# EAGLE schematic singleboard (EAGLE 6.6.0)

## Sheet 1 of 5
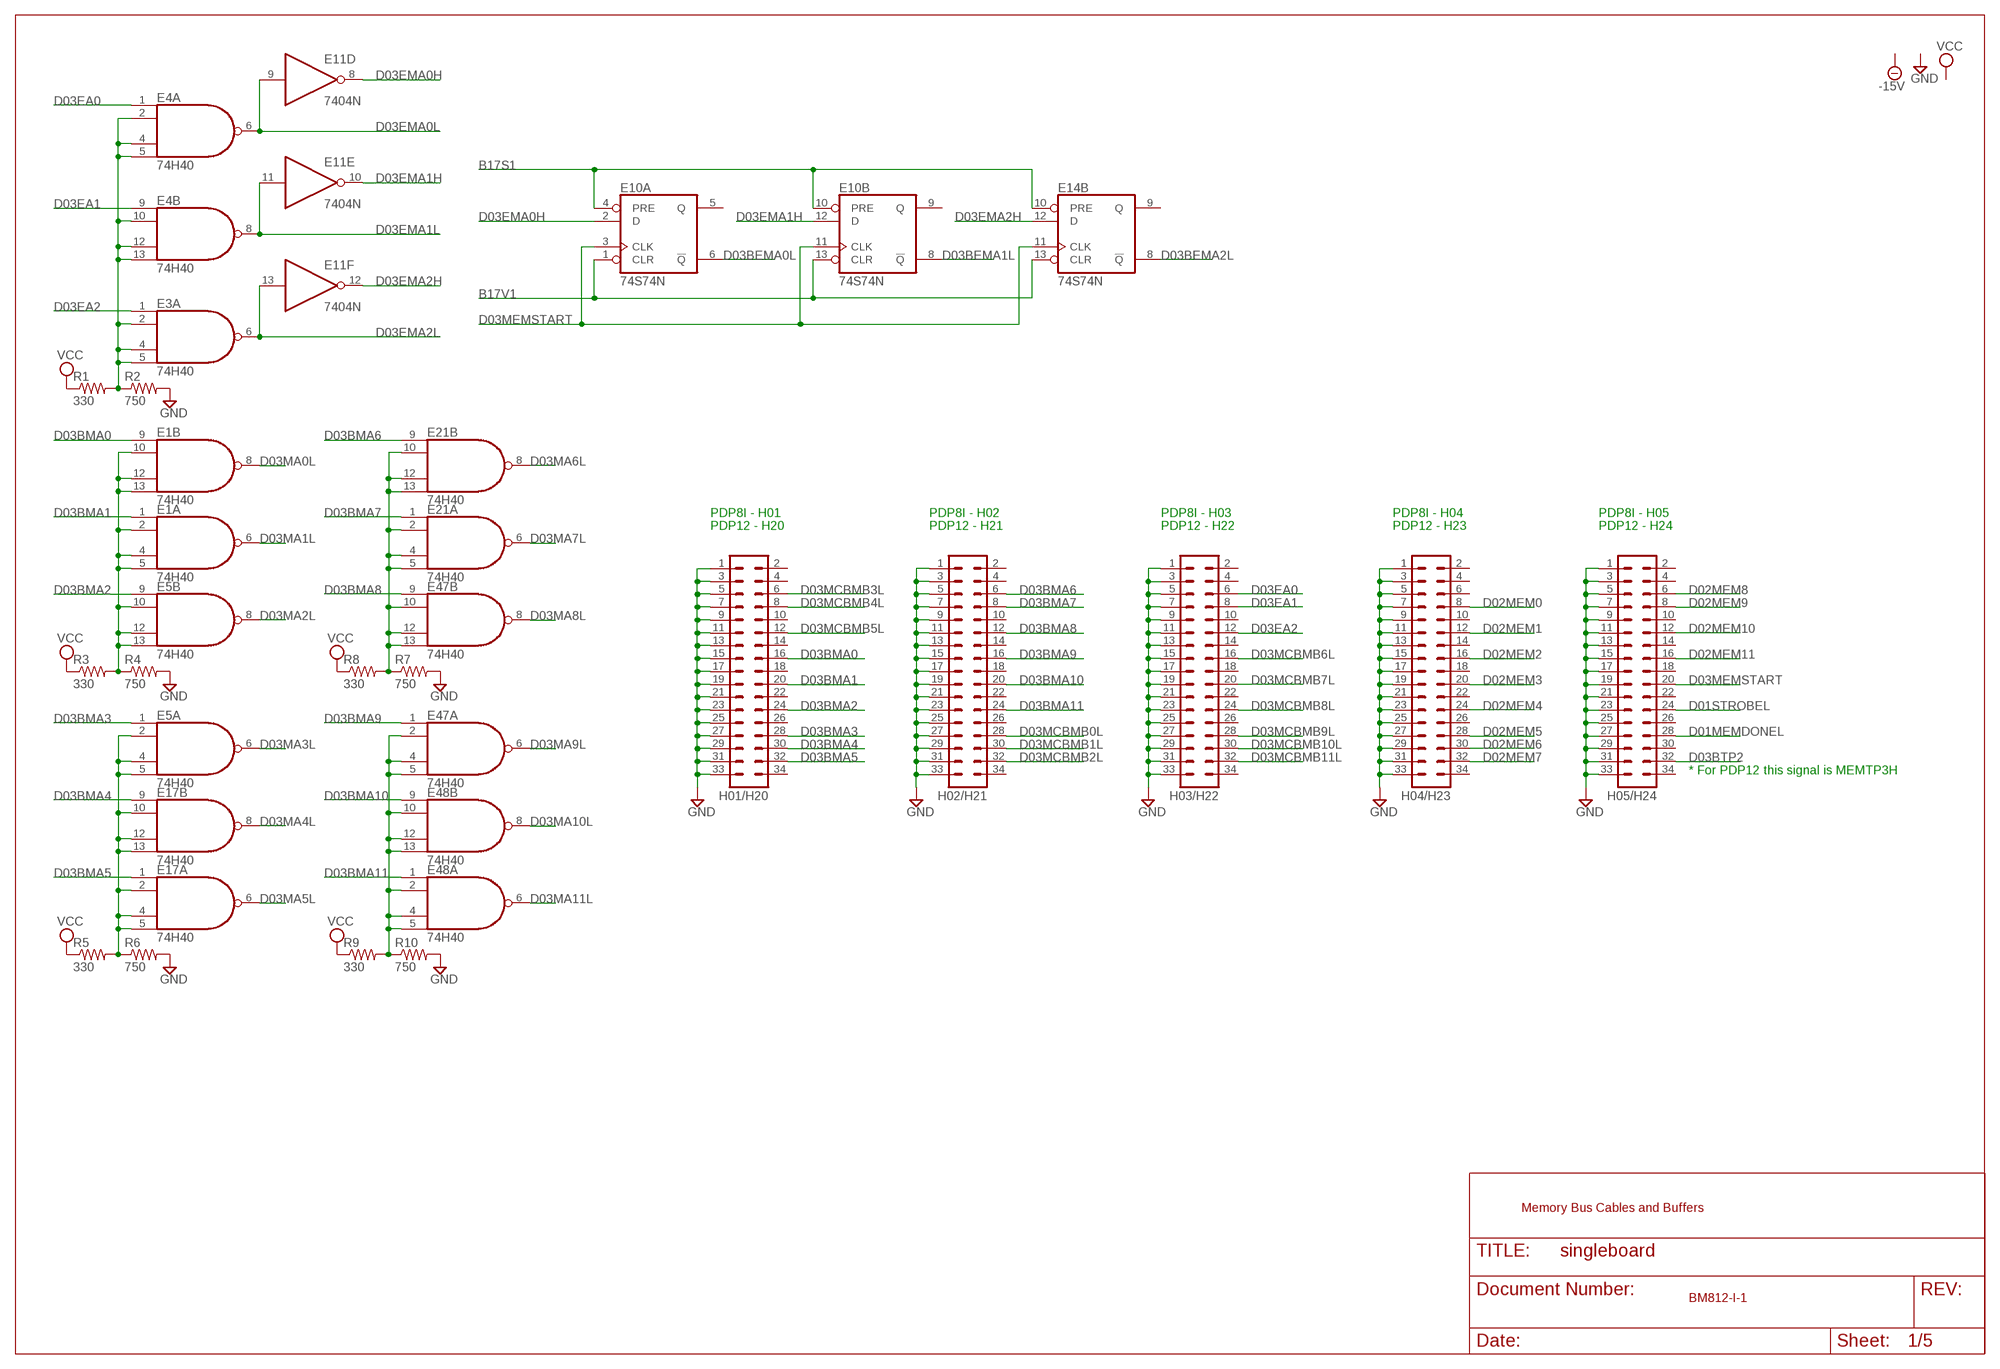
[diagram p0: schematic, sheet 1]

### Parts
E1  74H40  74S20N  [DIL14]
E3  74H40  74S20N  [DIL14]
E4  74H40  74S20N  [DIL14]
E5  74H40  74S20N  [DIL14]
E10  74S74N  [DIL14]
E11  7404N  [DIL14]
E14  74S74N  [DIL14]
E17  74H40  74S20N  [DIL14]
E21  74H40  74S20N  [DIL14]
E47  74H40  74S20N  [DIL14]
E48  74H40  74S20N  [DIL14]
H01/H20  MA17-2  [MA17-2]
H02/H21  MA17-2  [MA17-2]
H03/H22  MA17-2  [MA17-2]
H04/H23  MA17-2  [MA17-2]
H05/H24  MA17-2  [MA17-2]
R1  330  R-US_0207/10  [0207/10]
R2  750  R-US_0207/10  [0207/10]
R3  330  R-US_0207/10  [0207/10]
R4  750  R-US_0207/10  [0207/10]
R5  330  R-US_0207/10  [0207/10]
R6  750  R-US_0207/10  [0207/10]
R7  750  R-US_0207/10  [0207/10]
R8  330  R-US_0207/10  [0207/10]
R9  330  R-US_0207/10  [0207/10]
R10  750  R-US_0207/10  [0207/10]

### Nets
B17S1: E10.4(A:PRE) E10.10(B:PRE) E14.10(B:PRE) ; also sheet 3,4
B17V1: E10.1(A:CLR) E10.13(B:CLR) E14.13(B:CLR) ; also sheet 3,4
D01MEMDONEL: H05/H24.28 ; also sheet 4
D01STROBEL: H05/H24.24 ; also sheet 4
D02MEM0: H04/H23.8 ; also sheet 3
D02MEM1: H04/H23.12 ; also sheet 3
D02MEM2: H04/H23.16 ; also sheet 3
D02MEM3: H04/H23.20 ; also sheet 3
D02MEM4: H04/H23.24 ; also sheet 3
D02MEM5: H04/H23.28 ; also sheet 3
D02MEM6: H04/H23.30 ; also sheet 3
D02MEM7: H04/H23.32 ; also sheet 3
D02MEM8: H05/H24.6 ; also sheet 3
D02MEM9: H05/H24.8 ; also sheet 3
D02MEM10: H05/H24.12 ; also sheet 3
D02MEM11: H05/H24.16 ; also sheet 3
D03BEMA0L: E10.6(A:!Q) ; also sheet 5
D03BEMA1L: E10.8(B:!Q) ; also sheet 5
D03BEMA2L: E14.8(B:!Q) ; also sheet 5
D03BMA0: E1.9(B:I0) H01/H20.16
D03BMA1: E1.1(A:I0) H01/H20.20
D03BMA2: E5.9(B:I0) H01/H20.24
D03BMA3: E5.1(A:I0) H01/H20.28
D03BMA4: E17.9(B:I0) H01/H20.30
D03BMA5: E17.1(A:I0) H01/H20.32
D03BMA6: E21.9(B:I0) H02/H21.6
D03BMA7: E21.1(A:I0) H02/H21.8
D03BMA8: E47.9(B:I0) H02/H21.12
D03BMA9: E47.1(A:I0) H02/H21.16
D03BMA10: E48.9(B:I0) H02/H21.20
D03BMA11: E48.1(A:I0) H02/H21.24
D03BTP2: H05/H24.32 ; also sheet 4
D03EA0: E4.1(A:I0) H03/H22.6
D03EA1: E4.9(B:I0) H03/H22.8
D03EA2: E3.1(A:I0) H03/H22.12
D03EMA0H: E10.2(A:D) E11.8(D:O) ; also sheet 4
D03EMA0L: E4.6(A:O) E11.9(D:I) ; also sheet 4
D03EMA1H: E10.12(B:D) E11.10(E:O) ; also sheet 4
D03EMA1L: E4.8(B:O) E11.11(E:I) ; also sheet 4
D03EMA2H: E11.12(F:O) E14.12(B:D) ; also sheet 4
D03EMA2L: E3.6(A:O) E11.13(F:I) ; also sheet 4
D03MA0L: E1.8(B:O) ; also sheet 5
D03MA1L: E1.6(A:O) ; also sheet 5
D03MA2L: E5.8(B:O) ; also sheet 5
D03MA3L: E5.6(A:O) ; also sheet 5
D03MA4L: E17.8(B:O) ; also sheet 5
D03MA5L: E17.6(A:O) ; also sheet 5
D03MA6L: E21.8(B:O) ; also sheet 5
D03MA7L: E21.6(A:O) ; also sheet 5
D03MA8L: E47.8(B:O) ; also sheet 5
D03MA9L: E47.6(A:O) ; also sheet 5
D03MA10L: E48.8(B:O) ; also sheet 5
D03MA11L: E48.6(A:O) ; also sheet 5
D03MCBMB0L: H02/H21.28 ; also sheet 2
D03MCBMB1L: H02/H21.30 ; also sheet 2
D03MCBMB2L: H02/H21.32 ; also sheet 2
D03MCBMB3L: H01/H20.6 ; also sheet 2
D03MCBMB4L: H01/H20.8 ; also sheet 2
D03MCBMB5L: H01/H20.12 ; also sheet 2
D03MCBMB6L: H03/H22.16 ; also sheet 2
D03MCBMB7L: H03/H22.20 ; also sheet 2
D03MCBMB8L: H03/H22.24 ; also sheet 2
D03MCBMB9L: H03/H22.28 ; also sheet 2
D03MCBMB10L: H03/H22.30 ; also sheet 2
D03MCBMB11L: H03/H22.32 ; also sheet 2
D03MEMSTART: E10.3(A:CLK) E10.11(B:CLK) E14.11(B:CLK) H05/H24.20 ; also sheet 4
GND [Power]: H01/H20.1 H01/H20.3 H01/H20.5 H01/H20.7 H01/H20.9 H01/H20.11 H01/H20.13 H01/H20.15 H01/H20.17 H01/H20.19 H01/H20.21 H01/H20.23 H01/H20.25 H01/H20.27 H01/H20.29 H01/H20.31 H01/H20.33 H02/H21.1 H02/H21.3 H02/H21.5 H02/H21.7 H02/H21.9 H02/H21.11 H02/H21.13 H02/H21.15 H02/H21.17 H02/H21.19 H02/H21.21 H02/H21.23 H02/H21.25 H02/H21.27 H02/H21.29 H02/H21.31 H02/H21.33 H03/H22.1 H03/H22.3 H03/H22.5 H03/H22.7 H03/H22.9 H03/H22.11 H03/H22.13 H03/H22.15 H03/H22.17 H03/H22.19 H03/H22.21 H03/H22.23 H03/H22.25 H03/H22.27 H03/H22.29 H03/H22.31 H03/H22.33 H04/H23.1 H04/H23.3 H04/H23.5 H04/H23.7 H04/H23.9 H04/H23.11 H04/H23.13 H04/H23.15 H04/H23.17 H04/H23.19 H04/H23.21 H04/H23.23 H04/H23.25 H04/H23.27 H04/H23.29 H04/H23.31 H04/H23.33 H05/H24.1 H05/H24.3 H05/H24.5 H05/H24.7 H05/H24.9 H05/H24.11 H05/H24.13 H05/H24.15 H05/H24.17 H05/H24.19 H05/H24.21 H05/H24.23 H05/H24.25 H05/H24.27 H05/H24.29 H05/H24.31 H05/H24.33 R2.2 R4.2 R6.2 R7.2 R10.2 ; also sheet 2,4,5
N$1: E3.2(A:I1) E3.4(A:I2) E3.5(A:I3) E4.2(A:I1) E4.4(A:I2) E4.5(A:I3) E4.10(B:I1) E4.12(B:I2) E4.13(B:I3) R1.2 R2.1
N$2: E1.2(A:I1) E1.4(A:I2) E1.5(A:I3) E1.10(B:I1) E1.12(B:I2) E1.13(B:I3) E5.10(B:I1) E5.12(B:I2) E5.13(B:I3) R3.2 R4.1
N$4: E5.2(A:I1) E5.4(A:I2) E5.5(A:I3) E17.2(A:I1) E17.4(A:I2) E17.5(A:I3) E17.10(B:I1) E17.12(B:I2) E17.13(B:I3) R5.2 R6.1
N$6: E21.2(A:I1) E21.4(A:I2) E21.5(A:I3) E21.10(B:I1) E21.12(B:I2) E21.13(B:I3) E47.10(B:I1) E47.12(B:I2) E47.13(B:I3) R7.1 R8.2
N$36: E47.2(A:I1) E47.4(A:I2) E47.5(A:I3) E48.2(A:I1) E48.4(A:I2) E48.5(A:I3) E48.10(B:I1) E48.12(B:I2) E48.13(B:I3) R9.2 R10.1
VCC [Power]: R1.1 R3.1 R5.1 R8.1 R9.1 ; also sheet 2,4,5
Unconnected: E10.5(A:Q) E10.9(B:Q) E14.9(B:Q) H01/H20.2 H01/H20.4 H01/H20.10 H01/H20.14 H01/H20.18 H01/H20.22 H01/H20.26 H01/H20.34 H02/H21.2 H02/H21.4 H02/H21.10 H02/H21.14 H02/H21.18 H02/H21.22 H02/H21.26 H02/H21.34 H03/H22.2 H03/H22.4 H03/H22.10 H03/H22.14 H03/H22.18 H03/H22.22 H03/H22.26 H03/H22.34 H04/H23.2 H04/H23.4 H04/H23.6 H04/H23.10 H04/H23.14 H04/H23.18 H04/H23.22 H04/H23.26 H04/H23.34 H05/H24.2 H05/H24.4 H05/H24.10 H05/H24.14 H05/H24.18 H05/H24.22 H05/H24.26 H05/H24.30 H05/H24.34

### Notes on the sheet
- PDP8I - H01 | PDP8I - H02 | PDP8I - H03 | PDP8I - H04 | PDP8I - H05
- PDP12 - H20 | PDP12 - H21 | PDP12 - H22 | PDP12 - H23 | PDP12 - H24
- * For PDP12 this signal is MEMTP3H
- Memory Bus Cables and Buffers
- BM812-I-1

## Sheet 2 of 5
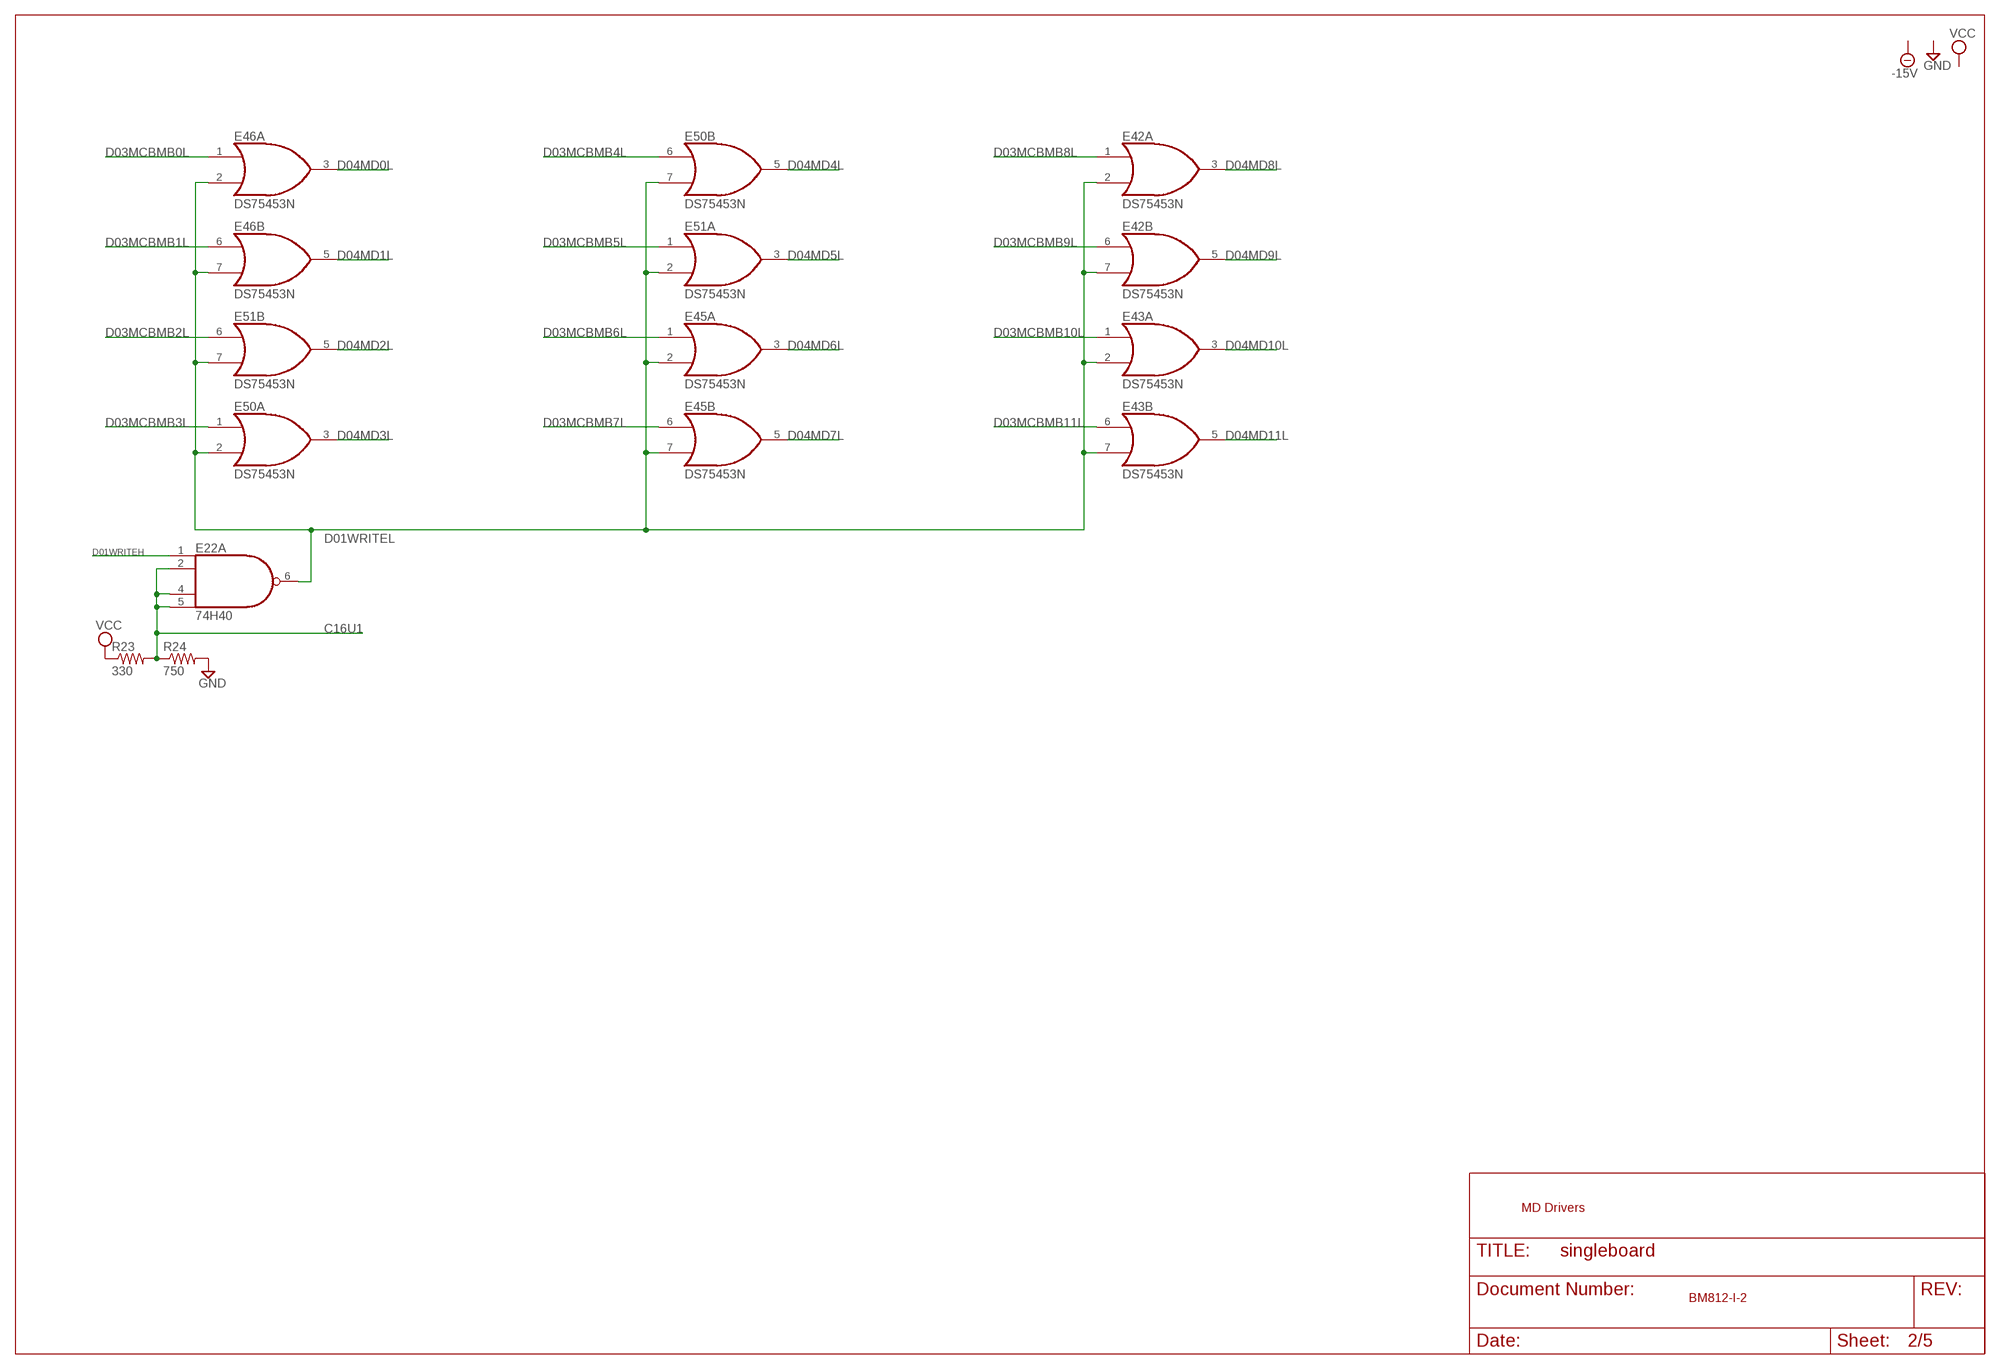
[diagram p1: schematic, sheet 2]

### Parts
E22  74H40  74S20N  [DIL14]
E42  DS75453N  [DIL08]
E43  DS75453N  [DIL08]
E45  DS75453N  [DIL08]
E46  DS75453N  [DIL08]
E50  DS75453N  [DIL08]
E51  DS75453N  [DIL08]
R23  330  R-US_0207/10  [0207/10]
R24  750  R-US_0207/10  [0207/10]

### Nets
C16U1: E22.2(A:I1) E22.4(A:I2) E22.5(A:I3) R23.2 R24.1 ; also sheet 3
D01WRITEH: E22.1(A:I0) ; also sheet 4
D01WRITEL: E22.6(A:O) E42.2(A:I1) E42.7(B:I1) E43.2(A:I1) E43.7(B:I1) E45.2(A:I1) E45.7(B:I1) E46.2(A:I1) E46.7(B:I1) E50.2(A:I1) E50.7(B:I1) E51.2(A:I1) E51.7(B:I1)
D03MCBMB0L: E46.1(A:I0) ; also sheet 1
D03MCBMB1L: E46.6(B:I0) ; also sheet 1
D03MCBMB2L: E51.6(B:I0) ; also sheet 1
D03MCBMB3L: E50.1(A:I0) ; also sheet 1
D03MCBMB4L: E50.6(B:I0) ; also sheet 1
D03MCBMB5L: E51.1(A:I0) ; also sheet 1
D03MCBMB6L: E45.1(A:I0) ; also sheet 1
D03MCBMB7L: E45.6(B:I0) ; also sheet 1
D03MCBMB8L: E42.1(A:I0) ; also sheet 1
D03MCBMB9L: E42.6(B:I0) ; also sheet 1
D03MCBMB10L: E43.1(A:I0) ; also sheet 1
D03MCBMB11L: E43.6(B:I0) ; also sheet 1
D04MD0L: E46.3(A:O) ; also sheet 3,5
D04MD1L: E46.5(B:O) ; also sheet 3,5
D04MD2L: E51.5(B:O) ; also sheet 3,5
D04MD3L: E50.3(A:O) ; also sheet 3,5
D04MD4L: E50.5(B:O) ; also sheet 3,5
D04MD5L: E51.3(A:O) ; also sheet 3,5
D04MD6L: E45.3(A:O) ; also sheet 3,5
D04MD7L: E45.5(B:O) ; also sheet 3,5
D04MD8L: E42.3(A:O) ; also sheet 3,5
D04MD9L: E42.5(B:O) ; also sheet 3,5
D04MD10L: E43.3(A:O) ; also sheet 3,5
D04MD11L: E43.5(B:O) ; also sheet 3,5
GND [Power]: R24.2 ; also sheet 1,4,5
VCC [Power]: R23.1 ; also sheet 1,4,5

### Notes on the sheet
- MD Drivers
- BM812-I-2

## Sheet 3 of 5
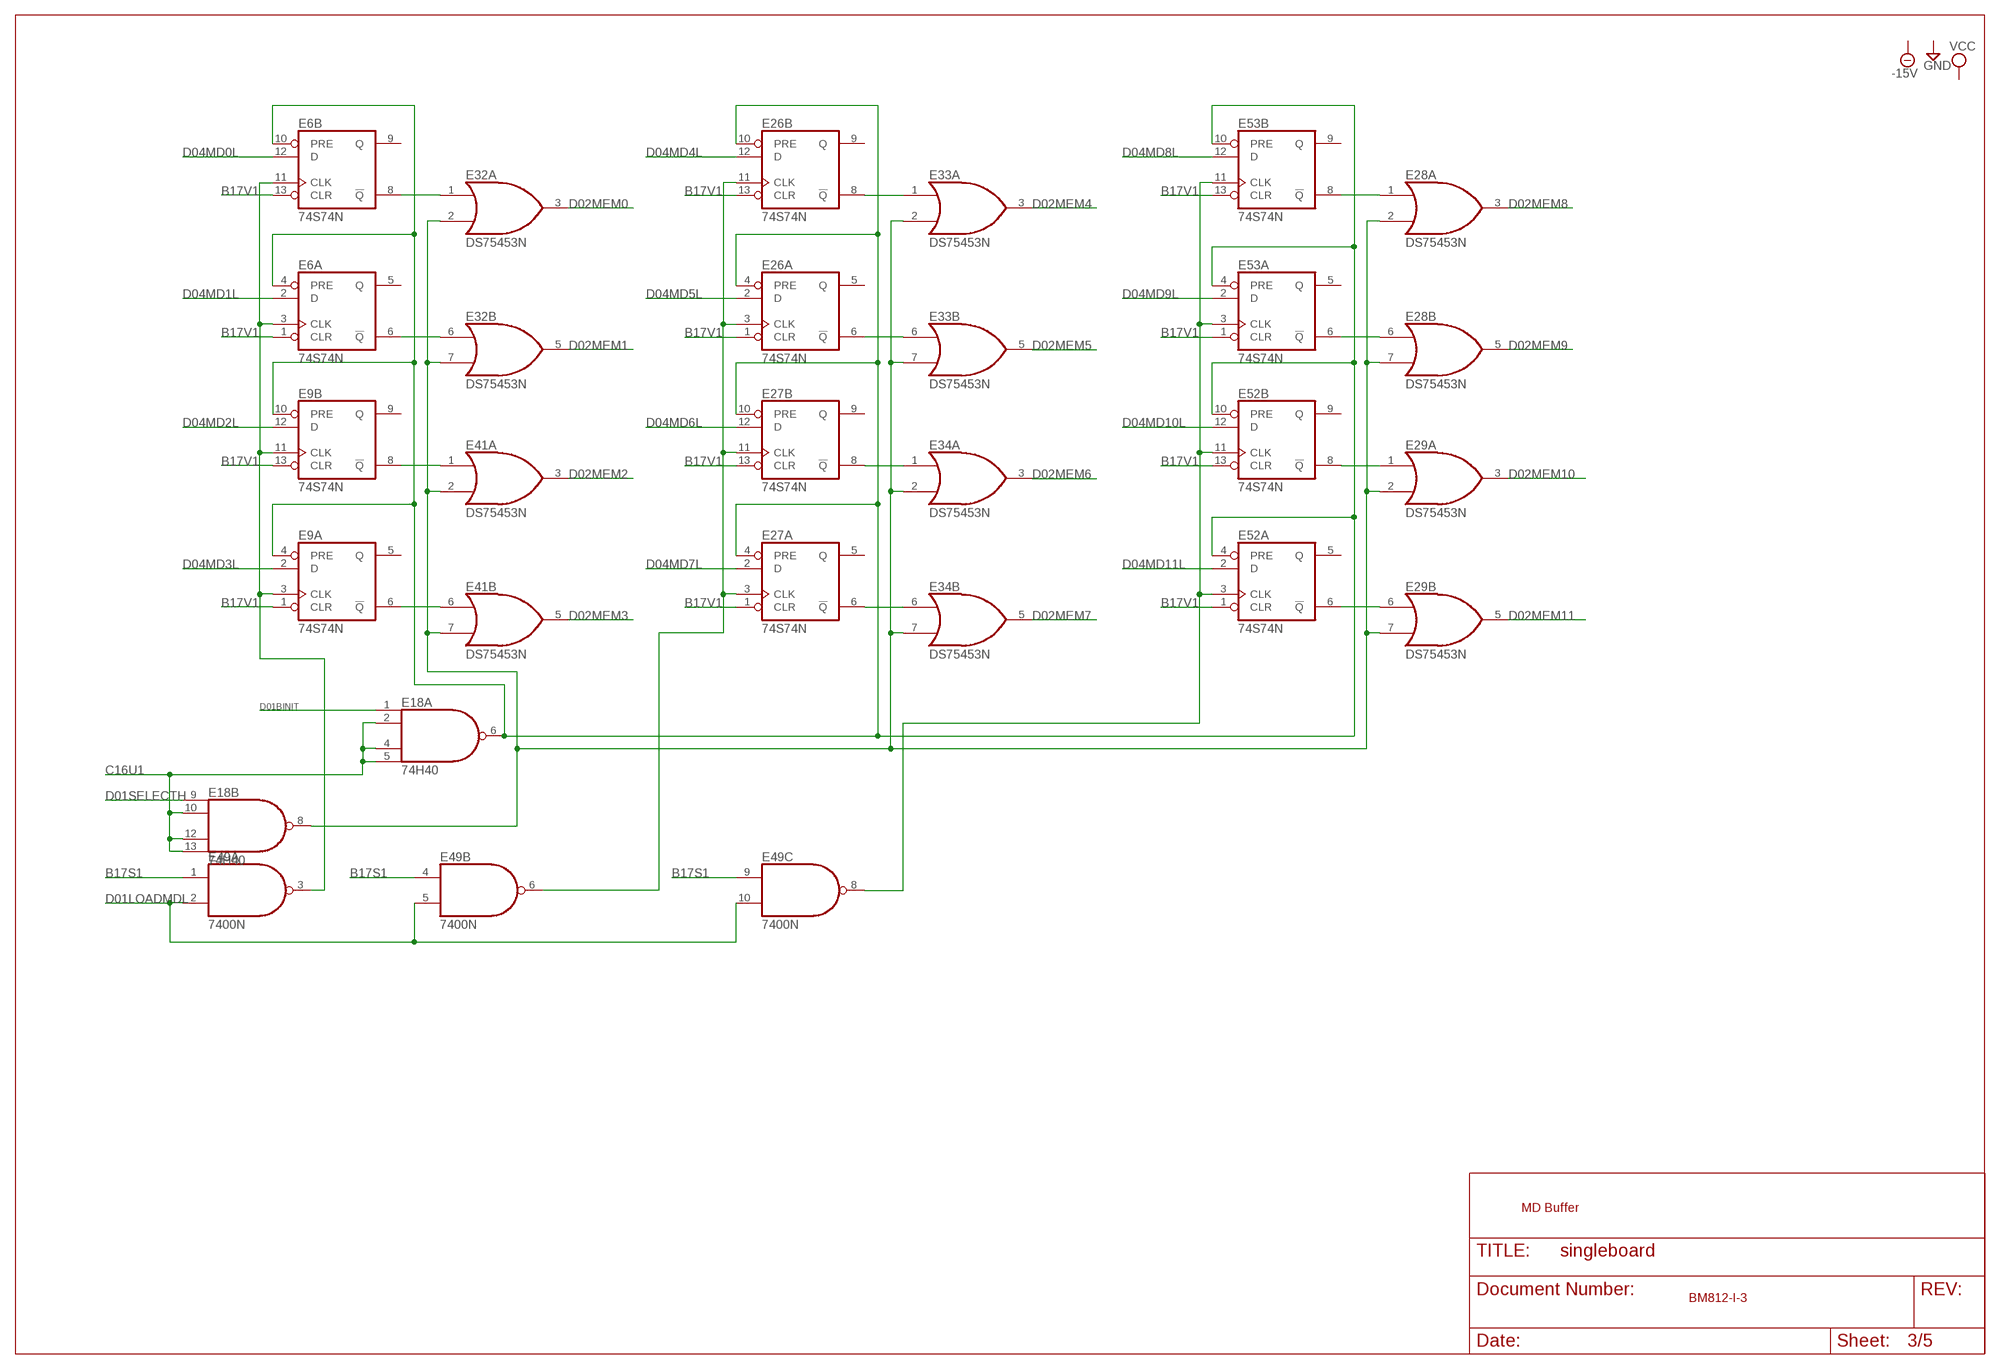
[diagram p2: schematic, sheet 3]

### Parts
E6  74S74N  [DIL14]
E9  74S74N  [DIL14]
E18  74H40  74S20N  [DIL14]
E26  74S74N  [DIL14]
E27  74S74N  [DIL14]
E28  DS75453N  [DIL08]
E29  DS75453N  [DIL08]
E32  DS75453N  [DIL08]
E33  DS75453N  [DIL08]
E34  DS75453N  [DIL08]
E41  DS75453N  [DIL08]
E49  7400N  [DIL14]
E52  74S74N  [DIL14]
E53  74S74N  [DIL14]

### Nets
B17S1: E49.1(A:I0) E49.4(B:I0) E49.9(C:I0) ; also sheet 1,4
B17V1: E6.1(A:CLR) E6.13(B:CLR) E9.1(A:CLR) E9.13(B:CLR) E26.1(A:CLR) E26.13(B:CLR) E27.1(A:CLR) E27.13(B:CLR) E52.1(A:CLR) E52.13(B:CLR) E53.1(A:CLR) E53.13(B:CLR) ; also sheet 1,4
C16U1: E18.2(A:I1) E18.4(A:I2) E18.5(A:I3) E18.10(B:I1) E18.12(B:I2) E18.13(B:I3) ; also sheet 2
D01BINIT: E18.1(A:I0) ; also sheet 4
D01LOADMDL: E49.2(A:I1) E49.5(B:I1) E49.10(C:I1) ; also sheet 4
D01SELECTH: E18.9(B:I0) ; also sheet 4
D02MEM0: E32.3(A:O) ; also sheet 1
D02MEM1: E32.5(B:O) ; also sheet 1
D02MEM2: E41.3(A:O) ; also sheet 1
D02MEM3: E41.5(B:O) ; also sheet 1
D02MEM4: E33.3(A:O) ; also sheet 1
D02MEM5: E33.5(B:O) ; also sheet 1
D02MEM6: E34.3(A:O) ; also sheet 1
D02MEM7: E34.5(B:O) ; also sheet 1
D02MEM8: E28.3(A:O) ; also sheet 1
D02MEM9: E28.5(B:O) ; also sheet 1
D02MEM10: E29.3(A:O) ; also sheet 1
D02MEM11: E29.5(B:O) ; also sheet 1
D04MD0L: E6.12(B:D) ; also sheet 2,5
D04MD1L: E6.2(A:D) ; also sheet 2,5
D04MD2L: E9.12(B:D) ; also sheet 2,5
D04MD3L: E9.2(A:D) ; also sheet 2,5
D04MD4L: E26.12(B:D) ; also sheet 2,5
D04MD5L: E26.2(A:D) ; also sheet 2,5
D04MD6L: E27.12(B:D) ; also sheet 2,5
D04MD7L: E27.2(A:D) ; also sheet 2,5
D04MD8L: E53.12(B:D) ; also sheet 2,5
D04MD9L: E53.2(A:D) ; also sheet 2,5
D04MD10L: E52.12(B:D) ; also sheet 2,5
D04MD11L: E52.2(A:D) ; also sheet 2,5
N$8: E6.3(A:CLK) E6.11(B:CLK) E9.3(A:CLK) E9.11(B:CLK) E49.3(A:O)
N$12: E9.6(A:!Q) E41.6(B:I0)
N$14: E6.8(B:!Q) E32.1(A:I0)
N$15: E6.6(A:!Q) E32.6(B:I0)
N$16: E26.3(A:CLK) E26.11(B:CLK) E27.3(A:CLK) E27.11(B:CLK) E49.6(B:O)
N$17: E9.8(B:!Q) E41.1(A:I0)
N$21: E6.4(A:PRE) E6.10(B:PRE) E9.4(A:PRE) E9.10(B:PRE) E18.6(A:O) E26.4(A:PRE) E26.10(B:PRE) E27.4(A:PRE) E27.10(B:PRE) E52.4(A:PRE) E52.10(B:PRE) E53.4(A:PRE) E53.10(B:PRE)
N$22: E18.8(B:O) E28.2(A:I1) E28.7(B:I1) E29.2(A:I1) E29.7(B:I1) E32.2(A:I1) E32.7(B:I1) E33.2(A:I1) E33.7(B:I1) E34.2(A:I1) E34.7(B:I1) E41.2(A:I1) E41.7(B:I1)
N$24: E26.6(A:!Q) E33.6(B:I0)
N$25: E27.6(A:!Q) E34.6(B:I0)
N$26: E27.8(B:!Q) E34.1(A:I0)
N$27: E26.8(B:!Q) E33.1(A:I0)
N$29: E29.6(B:I0) E52.6(A:!Q)
N$30: E29.1(A:I0) E52.8(B:!Q)
N$41: E49.8(C:O) E52.3(A:CLK) E52.11(B:CLK) E53.3(A:CLK) E53.11(B:CLK)
N$67: E28.6(B:I0) E53.6(A:!Q)
N$68: E28.1(A:I0) E53.8(B:!Q)
Unconnected: E6.5(A:Q) E6.9(B:Q) E9.5(A:Q) E9.9(B:Q) E26.5(A:Q) E26.9(B:Q) E27.5(A:Q) E27.9(B:Q) E52.5(A:Q) E52.9(B:Q) E53.5(A:Q) E53.9(B:Q)

### Notes on the sheet
- MD Buffer
- BM812-I-3

## Sheet 4 of 5
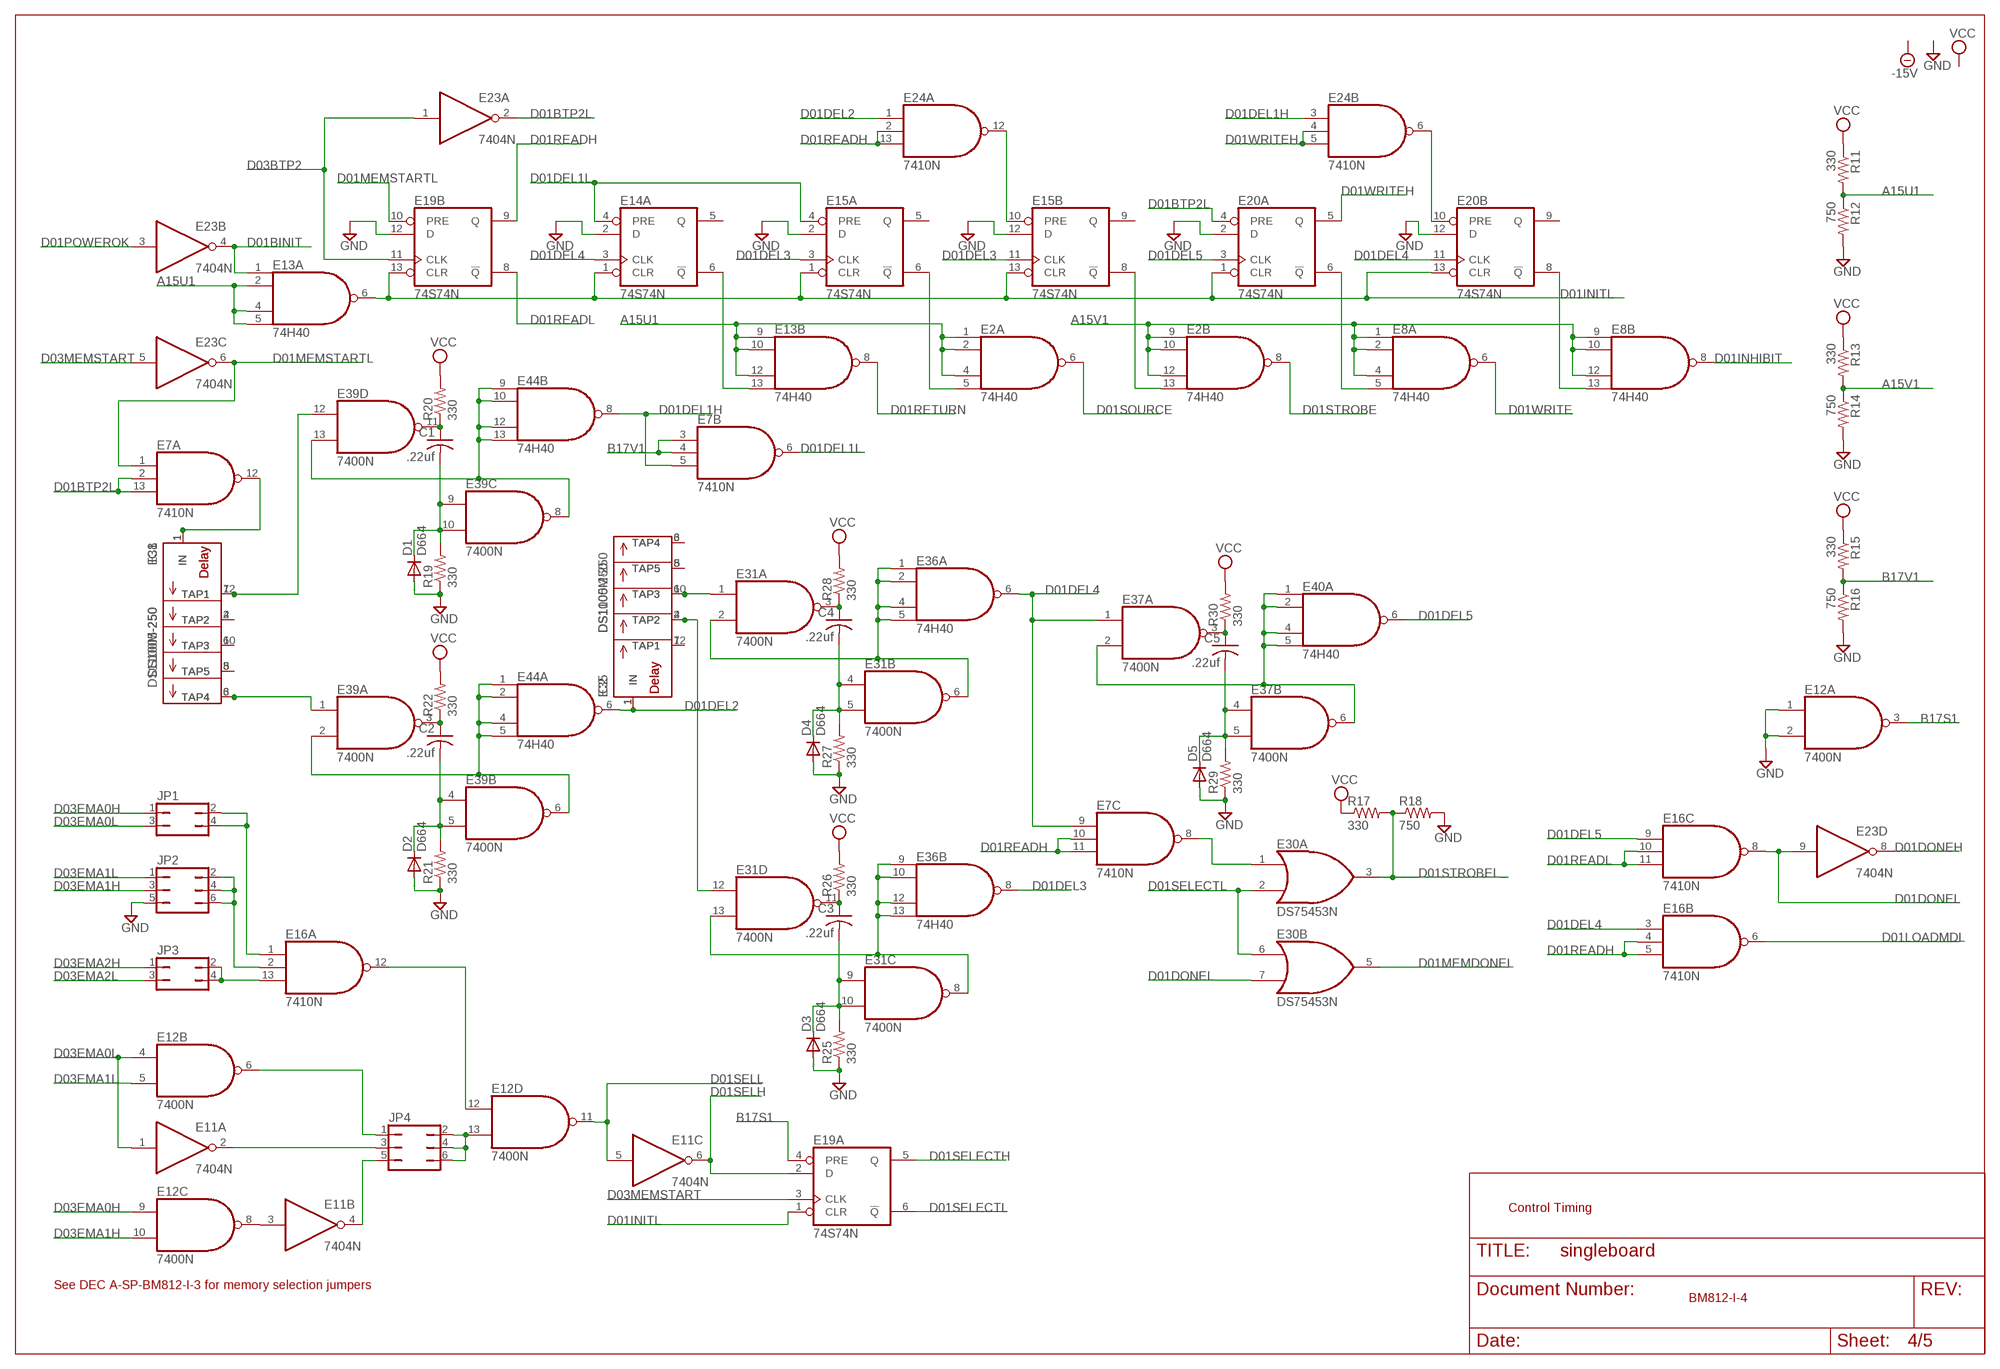
[diagram p3: schematic, sheet 4]

### Parts
C1  .22uf  C-US050-025X075  [C050-025X075]
C2  .22uf  C-US050-025X075  [C050-025X075]
C3  .22uf  C-US050-025X075  [C050-025X075]
C4  .22uf  C-US050-025X075  [C050-025X075]
C5  .22uf  C-US050-025X075  [C050-025X075]
D1  D664  1N4148DO35-10  [DO35-10]
D2  D664  1N4148DO35-10  [DO35-10]
D3  D664  1N4148DO35-10  [DO35-10]
D4  D664  1N4148DO35-10  [DO35-10]
D5  D664  1N4148DO35-10  [DO35-10]
E2  74H40  74S20N  [DIL14]
E7  7410N  [DIL14]
E8  74H40  74S20N  [DIL14]
E12  7400N  [DIL14]
E13  74H40  74S20N  [DIL14]
E15  74S74N  [DIL14]
E16  7410N  [DIL14]
E19  74S74N  [DIL14]
E20  74S74N  [DIL14]
E23  7404N  [DIL14]
E24  7410N  [DIL14]
E30  DS75453N  [DIL08]
E31  7400N  [DIL14]
E35  DS1005-250  MXD1000P  [DIL14]
E36  74H40  74S20N  [DIL14]
E37  7400N  [DIL14]
E38  DS1005-250  MXD1000P  [DIL14]
E39  7400N  [DIL14]
E40  74H40  74S20N  [DIL14]
E44  74H40  74S20N  [DIL14]
IC1  DS1100M-250  MXD1000  [DIL08]
IC2  DS1100M-250  MXD1000  [DIL08]
JP1  JP2Q  [JP2Q]
JP2  JP3Q  [JP3Q]
JP3  JP2Q  [JP2Q]
JP4  JP3Q  [JP3Q]
R11  330  R-US_0207/10  [0207/10]
R12  750  R-US_0207/10  [0207/10]
R13  330  R-US_0207/10  [0207/10]
R14  750  R-US_0207/10  [0207/10]
R15  330  R-US_0207/10  [0207/10]
R16  750  R-US_0207/10  [0207/10]
R17  330  R-US_0207/10  [0207/10]
R18  750  R-US_0207/10  [0207/10]
R19  330  R-US_0207/10  [0207/10]
R20  330  R-US_0207/10  [0207/10]
R21  330  R-US_0207/10  [0207/10]
R22  330  R-US_0207/10  [0207/10]
R25  330  R-US_0207/10  [0207/10]
R26  330  R-US_0207/10  [0207/10]
R27  330  R-US_0207/10  [0207/10]
R28  330  R-US_0207/10  [0207/10]
R29  330  R-US_0207/10  [0207/10]
R30  330  R-US_0207/10  [0207/10]

### Nets
A15U1: E2.1(A:I0) E2.2(A:I1) E2.4(A:I2) E13.2(A:I1) E13.4(A:I2) E13.5(A:I3) E13.9(B:I0) E13.10(B:I1) E13.12(B:I2) R11.2 R12.1 ; also sheet 5
A15V1: E2.9(B:I0) E2.10(B:I1) E2.12(B:I2) E8.1(A:I0) E8.2(A:I1) E8.4(A:I2) E8.9(B:I0) E8.10(B:I1) E8.12(B:I2) R13.2 R14.1
B17S1: E12.3(A:O) E19.4(A:PRE) ; also sheet 1,3
B17V1: E7.3(B:I0) E7.4(B:I1) R15.2 R16.1 ; also sheet 1,3
D01BINIT: E13.1(A:I0) E23.4(B:O) ; also sheet 3
D01BTP2L: E7.2(A:I1) E7.13(A:I2) E20.4(A:PRE) E23.2(A:O)
D01DEL1H: E7.5(B:I2) E24.3(B:I0) E44.8(B:O)
D01DEL1L: E7.6(B:O) E14.4(A:PRE) E15.4(A:PRE)
D01DEL2: E24.1(A:I0) E35.1(IN) E44.6(A:O) IC2.1(IN)
D01DEL3: E15.3(A:CLK) E15.11(B:CLK) E36.8(B:O)
D01DEL4: E7.9(C:I0) E14.3(A:CLK) E16.3(B:I0) E20.11(B:CLK) E36.6(A:O) E37.1(A:I0)
D01DEL5: E16.9(C:I0) E20.3(A:CLK) E40.6(A:O)
D01DONEH: E23.8(D:O) ; also sheet 5
D01DONEL: E16.8(C:O) E23.9(D:I) E30.7(B:I1)
D01INHIBIT: E8.8(B:O) ; also sheet 5
D01INITL: E13.6(A:O) E14.1(A:CLR) E15.1(A:CLR) E15.13(B:CLR) E19.1(A:CLR) E19.13(B:CLR) E20.1(A:CLR) E20.13(B:CLR)
D01LOADMDL: E16.6(B:O) ; also sheet 3
D01MEMDONEL: E30.5(B:O) ; also sheet 1
D01MEMSTARTL: E7.1(A:I0) E19.10(B:PRE) E23.6(C:O)
D01POWEROK: E23.3(B:I) ; also sheet 5
D01READH: E7.10(C:I1) E7.11(C:I2) E16.4(B:I1) E16.5(B:I2) E19.9(B:Q) E24.2(A:I1) E24.13(A:I2)
D01READL: E16.10(C:I1) E16.11(C:I2) E19.8(B:!Q) ; also sheet 5
D01RETURN: E13.8(B:O) ; also sheet 5
D01SELECTH: E19.5(A:Q) ; also sheet 3
D01SELECTL: E19.6(A:!Q) E30.2(A:I1) E30.6(B:I0)
D01SELH: E11.6(C:O) E19.2(A:D)
D01SELL: E11.5(C:I) E12.11(D:O)
D01SOURCE: E2.6(A:O) ; also sheet 5
D01STROBE: E2.8(B:O) ; also sheet 5
D01STROBEL: E30.3(A:O) R17.2 R18.1 ; also sheet 1
D01WRITE: E8.6(A:O) ; also sheet 5
D01WRITEH: E20.5(A:Q) E24.4(B:I1) E24.5(B:I2) ; also sheet 2
D03BTP2: E19.11(B:CLK) E23.1(A:I) ; also sheet 1
D03EMA0H: E12.9(C:I0) JP1.1 ; also sheet 1
D03EMA0L: E11.1(A:I) E12.4(B:I0) JP1.3 ; also sheet 1
D03EMA1H: E12.10(C:I1) JP2.3 ; also sheet 1
D03EMA1L: E12.5(B:I1) JP2.1 ; also sheet 1
D03EMA2H: JP3.1 ; also sheet 1
D03EMA2L: JP3.3 ; also sheet 1
D03MEMSTART: E19.3(A:CLK) E23.5(C:I) ; also sheet 1
GND [Power]: D1.A D2.A D3.A D4.A D5.A E12.1(A:I0) E12.2(A:I1) E14.2(A:D) E15.2(A:D) E15.12(B:D) E19.12(B:D) E20.2(A:D) E20.12(B:D) JP2.5 R12.2 R14.2 R16.2 R18.2 R19.1 R21.1 R25.1 R27.1 R29.1 ; also sheet 1,2,5
N$3: C3.2 D3.C E31.9(C:I0) E31.10(C:I1) R25.2
N$5: C5.2 D5.C E37.4(B:I0) E37.5(B:I1) R29.2
N$7: E12.13(D:I1) JP4.2 JP4.4 JP4.6
N$9: C2.2 D2.C E39.4(B:I0) E39.5(B:I1) R21.2
N$10: E38.12(TAP1) E39.12(D:I0) IC1.7(TAP1)
N$11: E31.12(D:I0) E35.4(TAP2) IC2.2(TAP2)
N$13: C1.2 D1.C E39.9(C:I0) E39.10(C:I1) R19.2
N$18: E39.8(C:O) E39.13(D:I1) E44.9(B:I0) E44.10(B:I1) E44.12(B:I2) E44.13(B:I3)
N$19: C1.1 E39.11(D:O) R20.1
N$20: C2.1 E39.3(A:O) R22.1
N$23: E39.2(A:I1) E39.6(B:O) E44.1(A:I0) E44.2(A:I1) E44.4(A:I2) E44.5(A:I3)
N$28: C3.1 E31.11(D:O) R26.1
N$31: E38.6(TAP4) E39.1(A:I0) IC1.3(TAP4)
N$32: E31.8(C:O) E31.13(D:I1) E36.9(B:I0) E36.10(B:I1) E36.12(B:I2) E36.13(B:I3)
N$33: C4.2 D4.C E31.4(B:I0) E31.5(B:I1) R27.2
N$34: C4.1 E31.3(A:O) R28.1
N$35: E7.12(A:O) E38.1(IN) IC1.1(IN)
N$37: E31.2(A:I1) E31.6(B:O) E36.1(A:I0) E36.2(A:I1) E36.4(A:I2) E36.5(A:I3)
N$38: E31.1(A:I0) E35.10(TAP3) IC2.6(TAP3)
N$39: C5.1 E37.3(A:O) R30.1
N$40: E37.2(A:I1) E37.6(B:O) E40.1(A:I0) E40.2(A:I1) E40.4(A:I2) E40.5(A:I3)
N$46: E15.10(B:PRE) E24.12(A:O)
N$48: E35.12(TAP1) IC2.7(TAP1)
N$49: E35.6(TAP4) IC2.3(TAP4)
N$50: E35.8(TAP5) IC2.5(TAP5)
N$51: E38.4(TAP2) IC1.2(TAP2)
N$52: E38.10(TAP3) IC1.6(TAP3)
N$53: E38.8(TAP5) IC1.5(TAP5)
N$73: E12.6(B:O) JP4.1
N$92: E20.10(B:PRE) E24.6(B:O)
N$94: E7.8(C:O) E30.1(A:I0)
N$96: E13.13(B:I3) E14.6(A:!Q)
N$100: E2.5(A:I3) E15.6(A:!Q)
N$101: E2.13(B:I3) E15.8(B:!Q)
N$103: E11.2(A:O) JP4.3
N$104: E8.5(A:I3) E20.6(A:!Q)
N$108: E11.3(B:I) E12.8(C:O)
N$109: E8.13(B:I3) E20.8(B:!Q)
N$111: E11.4(B:O) JP4.5
N$113: E16.13(A:I2) JP3.2 JP3.4
N$128: E16.2(A:I1) JP2.2 JP2.4 JP2.6
N$129: E16.1(A:I0) JP1.2 JP1.4
N$132: E12.12(D:I0) E16.12(A:O)
VCC [Power]: R11.1 R13.1 R15.1 R17.1 R20.2 R22.2 R26.2 R28.2 R30.2 ; also sheet 1,2,5
Unconnected: E14.5(A:Q) E15.5(A:Q) E15.9(B:Q) E20.9(B:Q) E35.2(NC) E35.3(NC) E35.5(NC) E35.9(NC) E35.11(NC) E35.13(NC) E38.2(NC) E38.3(NC) E38.5(NC) E38.9(NC) E38.11(NC) E38.13(NC)

### Notes on the sheet
- Control Timing
- See DEC A-SP-BM812-I-3 for memory selection jumpers
- BM812-I-4

## Sheet 5 of 5
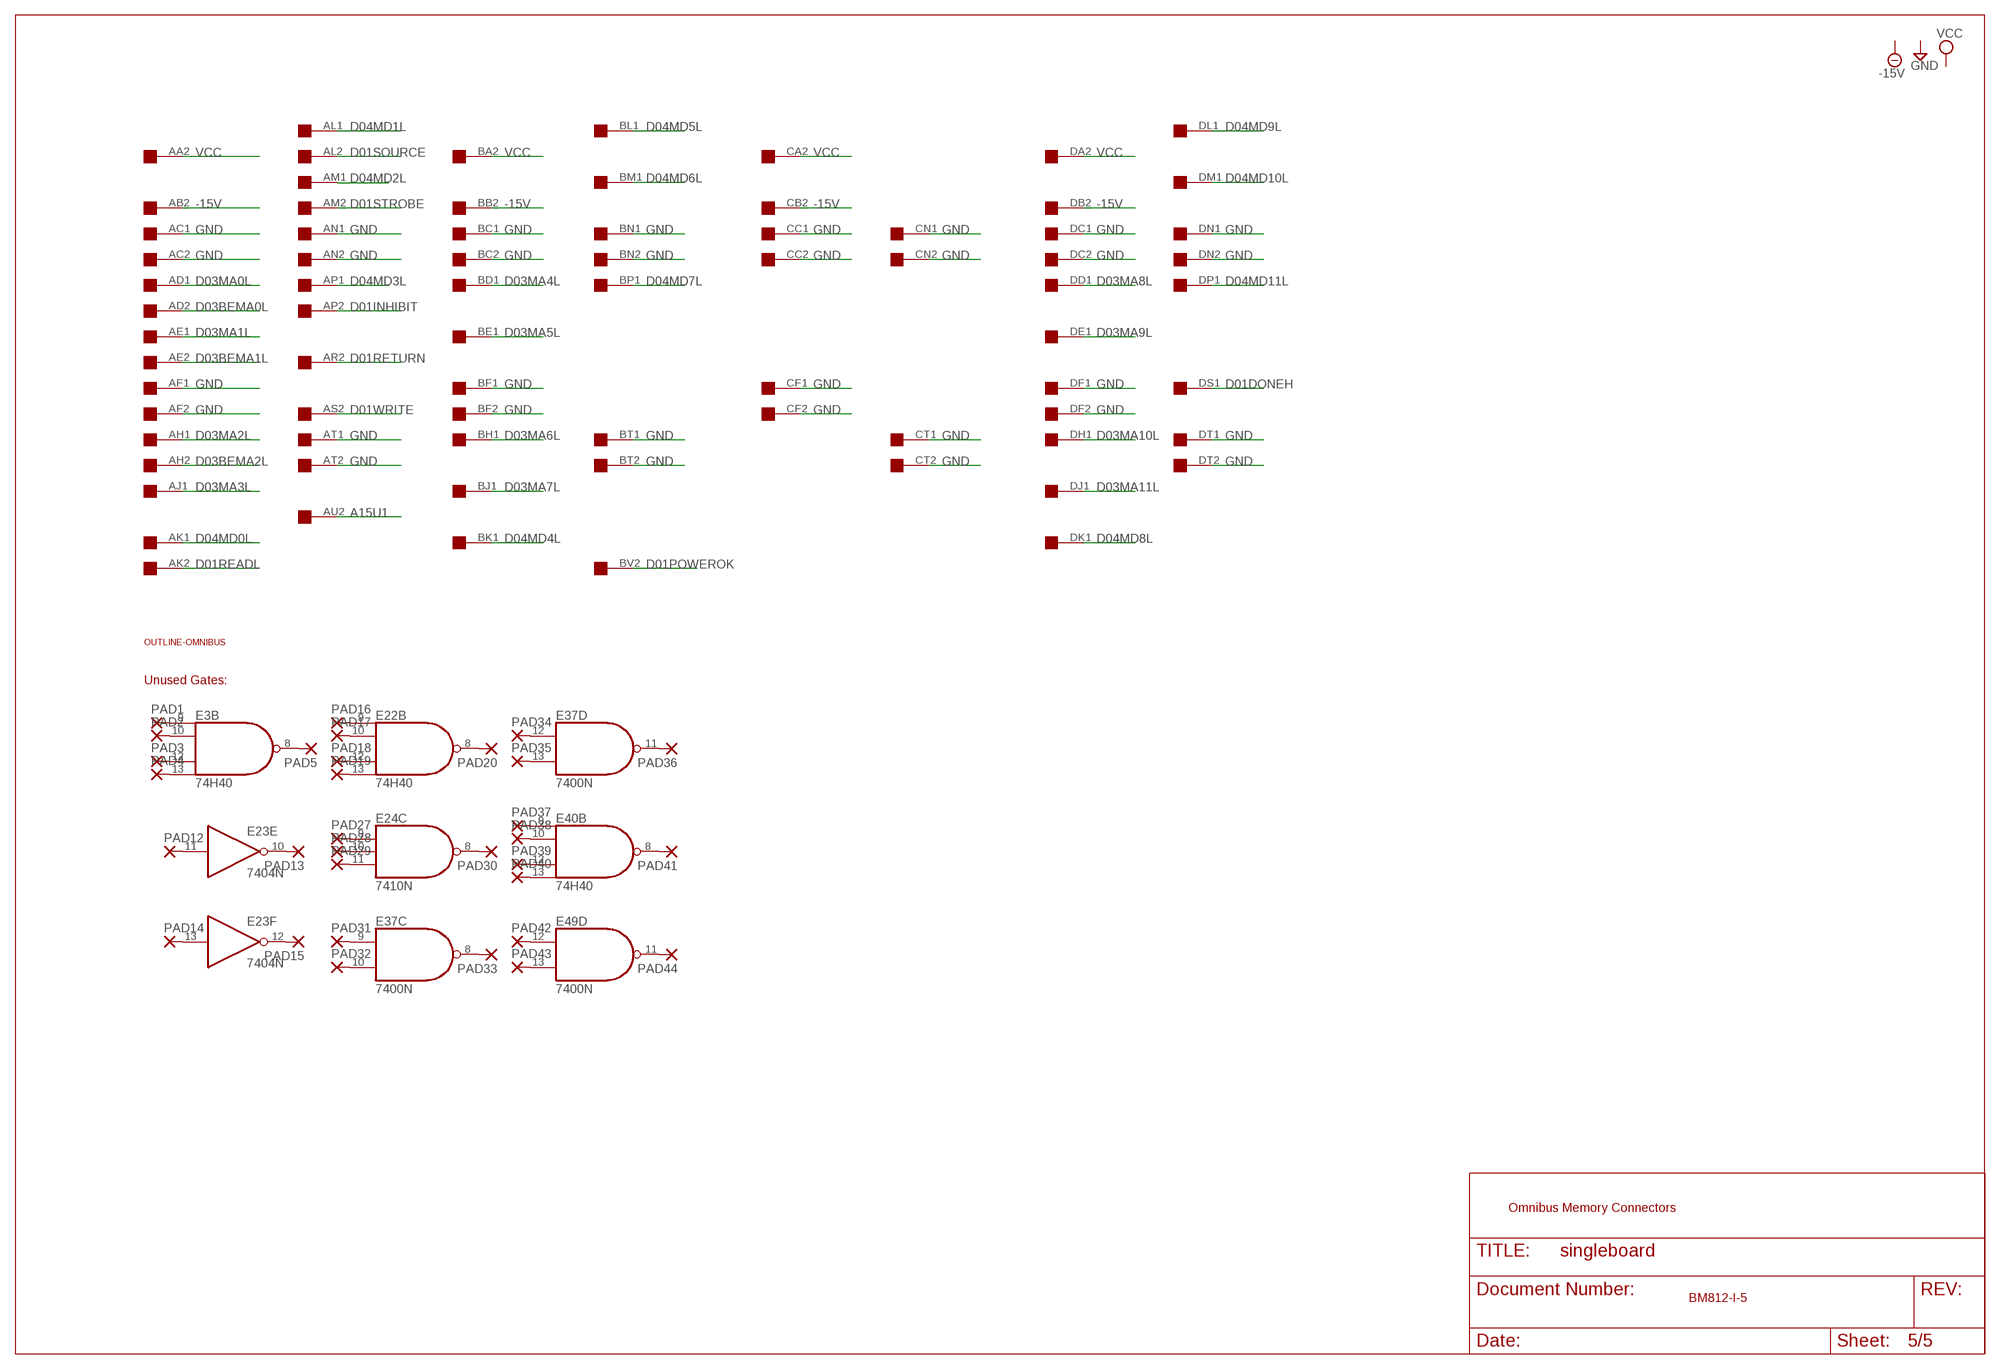
[diagram p4: schematic, sheet 5]

### Parts
PAD1  1,6/0,8  [1,6/0,8]
PAD2  1,6/0,8  [1,6/0,8]
PAD3  1,6/0,8  [1,6/0,8]
PAD4  1,6/0,8  [1,6/0,8]
PAD5  1,6/0,8  [1,6/0,8]
PAD12  1,6/0,8  [1,6/0,8]
PAD13  1,6/0,8  [1,6/0,8]
PAD14  1,6/0,8  [1,6/0,8]
PAD15  1,6/0,8  [1,6/0,8]
PAD16  1,6/0,8  [1,6/0,8]
PAD17  1,6/0,8  [1,6/0,8]
PAD18  1,6/0,8  [1,6/0,8]
PAD19  1,6/0,8  [1,6/0,8]
PAD20  1,6/0,8  [1,6/0,8]
PAD27  1,6/0,8  [1,6/0,8]
PAD28  1,6/0,8  [1,6/0,8]
PAD29  1,6/0,8  [1,6/0,8]
PAD30  1,6/0,8  [1,6/0,8]
PAD31  1,6/0,8  [1,6/0,8]
PAD32  1,6/0,8  [1,6/0,8]
PAD33  1,6/0,8  [1,6/0,8]
PAD34  1,6/0,8  [1,6/0,8]
PAD35  1,6/0,8  [1,6/0,8]
PAD36  1,6/0,8  [1,6/0,8]
PAD37  1,6/0,8  [1,6/0,8]
PAD38  1,6/0,8  [1,6/0,8]
PAD39  1,6/0,8  [1,6/0,8]
PAD40  1,6/0,8  [1,6/0,8]
PAD41  1,6/0,8  [1,6/0,8]
PAD42  1,6/0,8  [1,6/0,8]
PAD43  1,6/0,8  [1,6/0,8]
PAD44  1,6/0,8  [1,6/0,8]
U$1  QUAD  [EDGE-CON8]
U$2  OUTLINE-OMNIBUS  [OMNIBUS]

### Nets
-15V [Power]: U$1.AB2 U$1.BB2 U$1.CB2 U$1.DB2
A15U1: U$1.AU2 ; also sheet 4
D01DONEH: U$1.DS1 ; also sheet 4
D01INHIBIT: U$1.AP2 ; also sheet 4
D01POWEROK: U$1.BV2 ; also sheet 4
D01READL: U$1.AK2 ; also sheet 4
D01RETURN: U$1.AR2 ; also sheet 4
D01SOURCE: U$1.AL2 ; also sheet 4
D01STROBE: U$1.AM2 ; also sheet 4
D01WRITE: U$1.AS2 ; also sheet 4
D03BEMA0L: U$1.AD2 ; also sheet 1
D03BEMA1L: U$1.AE2 ; also sheet 1
D03BEMA2L: U$1.AH2 ; also sheet 1
D03MA0L: U$1.AD1 ; also sheet 1
D03MA1L: U$1.AE1 ; also sheet 1
D03MA2L: U$1.AH1 ; also sheet 1
D03MA3L: U$1.AJ1 ; also sheet 1
D03MA4L: U$1.BD1 ; also sheet 1
D03MA5L: U$1.BE1 ; also sheet 1
D03MA6L: U$1.BH1 ; also sheet 1
D03MA7L: U$1.BJ1 ; also sheet 1
D03MA8L: U$1.DD1 ; also sheet 1
D03MA9L: U$1.DE1 ; also sheet 1
D03MA10L: U$1.DH1 ; also sheet 1
D03MA11L: U$1.DJ1 ; also sheet 1
D04MD0L: U$1.AK1 ; also sheet 2,3
D04MD1L: U$1.AL1 ; also sheet 2,3
D04MD2L: U$1.AM1 ; also sheet 2,3
D04MD3L: U$1.AP1 ; also sheet 2,3
D04MD4L: U$1.BK1 ; also sheet 2,3
D04MD5L: U$1.BL1 ; also sheet 2,3
D04MD6L: U$1.BM1 ; also sheet 2,3
D04MD7L: U$1.BP1 ; also sheet 2,3
D04MD8L: U$1.DK1 ; also sheet 2,3
D04MD9L: U$1.DL1 ; also sheet 2,3
D04MD10L: U$1.DM1 ; also sheet 2,3
D04MD11L: U$1.DP1 ; also sheet 2,3
GND [Power]: U$1.AC1 U$1.AC2 U$1.AF1 U$1.AF2 U$1.AN1 U$1.AN2 U$1.AT1 U$1.AT2 U$1.BC1 U$1.BC2 U$1.BF1 U$1.BF2 U$1.BN1 U$1.BN2 U$1.BT1 U$1.BT2 U$1.CC1 U$1.CC2 U$1.CF1 U$1.CF2 U$1.CN1 U$1.CN2 U$1.CT1 U$1.CT2 U$1.DC1 U$1.DC2 U$1.DF1 U$1.DF2 U$1.DN1 U$1.DN2 U$1.DT1 U$1.DT2 ; also sheet 1,2,4
N$42: E3.9(B:I0) PAD1.1(P)
N$43: E3.10(B:I1) PAD2.1(P)
N$44: E3.12(B:I2) PAD3.1(P)
N$45: E3.13(B:I3) PAD4.1(P)
N$47: E3.8(B:O) PAD5.1(P)
N$54: E23.11(E:I) PAD12.1(P)
N$55: E23.10(E:O) PAD13.1(P)
N$56: E23.13(F:I) PAD14.1(P)
N$57: E23.12(F:O) PAD15.1(P)
N$58: E22.9(B:I0) PAD16.1(P)
N$59: E22.10(B:I1) PAD17.1(P)
N$60: E22.12(B:I2) PAD18.1(P)
N$61: E22.13(B:I3) PAD19.1(P)
N$62: E22.8(B:O) PAD20.1(P)
N$71: E24.9(C:I0) PAD27.1(P)
N$72: E24.10(C:I1) PAD28.1(P)
N$74: E24.11(C:I2) PAD29.1(P)
N$75: E24.8(C:O) PAD30.1(P)
N$76: E37.9(C:I0) PAD31.1(P)
N$77: E37.10(C:I1) PAD32.1(P)
N$78: E37.8(C:O) PAD33.1(P)
N$79: E37.12(D:I0) PAD34.1(P)
N$80: E37.13(D:I1) PAD35.1(P)
N$81: E37.11(D:O) PAD36.1(P)
N$82: E40.9(B:I0) PAD37.1(P)
N$83: E40.10(B:I1) PAD38.1(P)
N$84: E40.12(B:I2) PAD39.1(P)
N$85: E40.13(B:I3) PAD40.1(P)
N$86: E40.8(B:O) PAD41.1(P)
N$87: E49.12(D:I0) PAD42.1(P)
N$88: E49.13(D:I1) PAD43.1(P)
N$89: E49.11(D:O) PAD44.1(P)
VCC [Power]: U$1.AA2 U$1.BA2 U$1.CA2 U$1.DA2 ; also sheet 1,2,4
Unconnected: U$1.AA1 U$1.AB1 U$1.AJ2 U$1.AR1 U$1.AS1 U$1.AU1 U$1.AV1 U$1.AV2 U$1.BA1 U$1.BB1 U$1.BD2 U$1.BE2 U$1.BH2 U$1.BJ2 U$1.BK2 U$1.BL2 U$1.BM2 U$1.BP2 U$1.BR1 U$1.BR2 U$1.BS1 U$1.BS2 U$1.BU1 U$1.BU2 U$1.BV1 U$1.CA1 U$1.CB1 U$1.CD1 U$1.CD2 U$1.CE1 U$1.CE2 U$1.CH1 U$1.CH2 U$1.CJ1 U$1.CJ2 U$1.CK1 U$1.CK2 U$1.CL1 U$1.CL2 U$1.CM1 U$1.CM2 U$1.CP1 U$1.CP2 U$1.CR1 U$1.CR2 U$1.CS1 U$1.CS2 U$1.CU1 U$1.CU2 U$1.CV1 U$1.CV2 U$1.DA1 U$1.DB1 U$1.DD2 U$1.DE2 U$1.DH2 U$1.DJ2 U$1.DK2 U$1.DL2 U$1.DM2 U$1.DP2 U$1.DR1 U$1.DR2 U$1.DS2 U$1.DU1 U$1.DU2 U$1.DV1 U$1.DV2

### Notes on the sheet
- Unused Gates:
- Omnibus Memory Connectors
- BM812-I-5

## Power pins joined to a net without a drawn wire
GND: E1.7(P:GND) E2.7(P:GND) E3.7(P:GND) E4.7(P:GND) E5.7(P:GND) E6.7(P:GND) E7.7(P:GND) E8.7(P:GND) E9.7(P:GND) E10.7(P:GND) E11.7(P:GND) E12.7(P:GND) E13.7(P:GND) E14.7(P:GND) E15.7(P:GND) E16.7(P:GND) E17.7(P:GND) E18.7(P:GND) E19.7(P:GND) E20.7(P:GND) E21.7(P:GND) E22.7(P:GND) E23.7(P:GND) E24.7(P:GND) E26.7(P:GND) E27.7(P:GND) E28.4(P:GND) E29.4(P:GND) E30.4(P:GND) E31.7(P:GND) E32.4(P:GND) E33.4(P:GND) E34.4(P:GND) E35.7(GND) E36.7(P:GND) E37.7(P:GND) E38.7(GND) E39.7(P:GND) E40.7(P:GND) E41.4(P:GND) E42.4(P:GND) E43.4(P:GND) E44.7(P:GND) E45.4(P:GND) E46.4(P:GND) E47.7(P:GND) E48.7(P:GND) E49.7(P:GND) E50.4(P:GND) E51.4(P:GND) E52.7(P:GND) E53.7(P:GND) IC1.4(GND) IC2.4(GND)
VCC: E1.14(P:VCC) E2.14(P:VCC) E3.14(P:VCC) E4.14(P:VCC) E5.14(P:VCC) E6.14(P:VCC) E7.14(P:VCC) E8.14(P:VCC) E9.14(P:VCC) E10.14(P:VCC) E11.14(P:VCC) E12.14(P:VCC) E13.14(P:VCC) E14.14(P:VCC) E15.14(P:VCC) E16.14(P:VCC) E17.14(P:VCC) E18.14(P:VCC) E19.14(P:VCC) E20.14(P:VCC) E21.14(P:VCC) E22.14(P:VCC) E23.14(P:VCC) E24.14(P:VCC) E26.14(P:VCC) E27.14(P:VCC) E28.8(P:VCC) E29.8(P:VCC) E30.8(P:VCC) E31.14(P:VCC) E32.8(P:VCC) E33.8(P:VCC) E34.8(P:VCC) E35.14(VCC) E36.14(P:VCC) E37.14(P:VCC) E38.14(VCC) E39.14(P:VCC) E40.14(P:VCC) E41.8(P:VCC) E42.8(P:VCC) E43.8(P:VCC) E44.14(P:VCC) E45.8(P:VCC) E46.8(P:VCC) E47.14(P:VCC) E48.14(P:VCC) E49.14(P:VCC) E50.8(P:VCC) E51.8(P:VCC) E52.14(P:VCC) E53.14(P:VCC) IC1.8(VCC) IC2.8(VCC)

## Library data of the parts
C1-C5 = rcl:C-US: CAPACITOR, American symbol
D1-D5 = diode:1N4148: DIODE high speed (Philips)
E1-E5 E8 E13 E17 E18 E21 E22 E36 E40 E44 E47 E48 = 74xx-us:74*20: Dual 4-input NAND gate
E6 E9 E10 E14 E15 E19 E20 E26 E27 E52 E53 = 74xx-us:74*74: Dual D type positive edge triggered FLIP FLOP, preset and clear
E7 E16 E24 = 74xx-us:74*10: Triple 3-input NAND gate
E11 E23 = 74xx-us:74*04: Hex INVERTER
E12 E31 E37 E39 E49 = 74xx-us:74*00: Quad 2-input NAND gate
E28-E30 E32-E34 E41-E43 E45 E46 E50 E51 = dec-con:DS75453: Quad 2-input OR gate, open collector output
E35 E38 = maxim:MXD1000P: DELAY LINE; OC_FARNELL: unknown; OC_NEWARK: unknown
H01/H20 H02/H21 H03/H22 H04/H23 H05/H24 = con-lstb:MA17-2: PIN HEADER; OC_FARNELL: unknown; OC_NEWARK: unknown
IC1 IC2 = maxim:MXD1000: DELAY LINE; OC_FARNELL: unknown; OC_NEWARK: unknown
JP1 JP3 = dec-con:JP2Q: JUMPER
JP2 JP4 = jumper:JP3Q: JUMPER
PAD1-PAD5 PAD12-PAD20 PAD27-PAD44 = wirepad:1,6/0,8: THROUGH-HOLE PAD
R1-R30 = rcl:R-US_: RESISTOR, American symbol
U$1 = dec-con:QUAD: Quad-Height DEC board
U$2 = dec-con:OUTLINE-*: Board outlines for DEC boards.

## Net classes
1 Power: width 0.635 mm